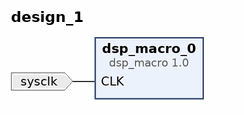
[diagram p0: block diagram of the top level]
# Vivado block design design_1, xc7a15tcpg236-1, Vivado 2021.1
create_bd_design design_1

create_bd_port -dir I -type clk sysclk
set_property -dict {CONFIG.FREQ_HZ 12000000} [get_bd_ports sysclk]

create_bd_cell -type ip -vlnv xilinx.com:ip:dsp_macro:1.0 dsp_macro_0
set_property -dict [list \
  CONFIG.a_width 2 \
  CONFIG.areg_3 true \
  CONFIG.areg_4 true \
  CONFIG.b_width 2 \
  CONFIG.breg_3 true \
  CONFIG.breg_4 true \
  CONFIG.c_width 2 \
  CONFIG.creg_3 true \
  CONFIG.creg_4 true \
  CONFIG.creg_5 true \
  CONFIG.d_width 2 \
  CONFIG.dreg_3 true \
  CONFIG.has_d_ce false \
  CONFIG.instruction1 {A*B+C} \
  CONFIG.instruction2 {(A+D)*B} \
  CONFIG.instruction3 {#} \
  CONFIG.instruction4 {#} \
  CONFIG.instruction5 {#} \
  CONFIG.instruction6 {#} \
  CONFIG.instruction7 {#} \
  CONFIG.instruction8 {#} \
  CONFIG.mreg_5 true \
  CONFIG.opreg_3 true \
  CONFIG.opreg_4 true \
  CONFIG.opreg_5 true \
  CONFIG.output_properties Full_Precision \
  CONFIG.p_binarywidth 0 \
  CONFIG.p_full_width 6 \
  CONFIG.p_width 6 \
  CONFIG.preg_6 true \
  CONFIG.show_filtered false \
] [get_bd_cells dsp_macro_0]

# ---- connections ----

connect_bd_net [get_bd_ports sysclk] [get_bd_pins dsp_macro_0/CLK]

validate_bd_design
save_bd_design
